# Altium schematic sheet QCopterRC_ETH_Sch.SchDoc
size A4
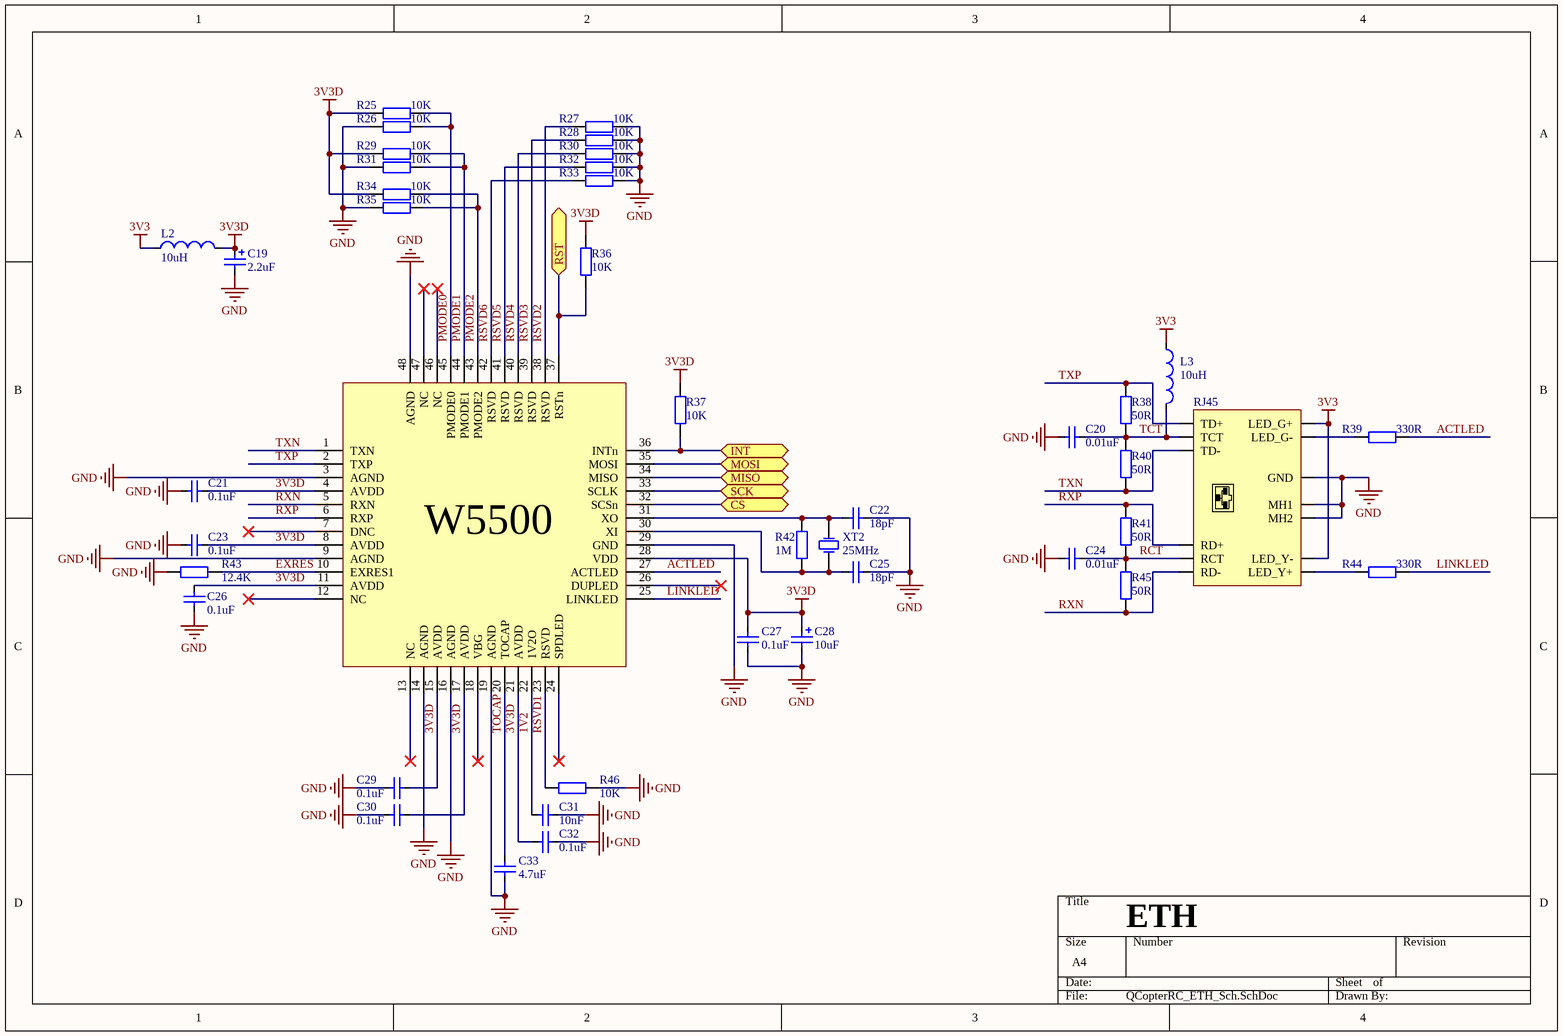
[diagram p0: QCopterRC_ETH_Sch.SchDoc]

## Parts
C19  value 2.2uF  [CAP_TAN_P0805]  (hidden comment: Cap_Tan_0805)
C20  value 0.01uF  [CAP_0603]  (hidden comment: Cap_0603)
C21  value 0.1uF  [CAP_0603]  (hidden comment: Cap_0603)
C22  value 18pF  [CAP_0603]  (hidden comment: Cap_0603)
C23  value 0.1uF  [CAP_0603]  (hidden comment: Cap_0603)
C24  value 0.01uF  [CAP_0603]  (hidden comment: Cap_0603)
C25  value 18pF  [CAP_0603]  (hidden comment: Cap_0603)
C26  value 0.1uF  [CAP_0603]  (hidden comment: Cap_0603)
C27  value 0.1uF  [CAP_0603]  (hidden comment: Cap_0603)
C28  value 10uF  [CAP_TAN_B1210]  (hidden comment: Cap_Tan_1210)
C29  value 0.1uF  [CAP_0603]  (hidden comment: Cap_0603)
C30  value 0.1uF  [CAP_0603]  (hidden comment: Cap_0603)
C31  value 10nF  [CAP_0603]  (hidden comment: Cap_0603)
C32  value 0.1uF  [CAP_0603]  (hidden comment: Cap_0603)
C33  value 4.7uF  [CAP_0603]  (hidden comment: Cap_0603)
L2  value 10uH  [IND_0603]  (hidden comment: Ind_0603)
L3  value 10uH  [IND_0603]  (hidden comment: Ind_0603)
R25  value 10K  [RES_0603]  (hidden comment: Res_0603)
R26  value 10K  [RES_0603]  (hidden comment: Res_0603)
R27  value 10K  [RES_0603]  (hidden comment: Res_0603)
R28  value 10K  [RES_0603]  (hidden comment: Res_0603)
R29  value 10K  [RES_0603]  (hidden comment: Res_0603)
R30  value 10K  [RES_0603]  (hidden comment: Res_0603)
R31  value 10K  [RES_0603]  (hidden comment: Res_0603)
R32  value 10K  [RES_0603]  (hidden comment: Res_0603)
R33  value 10K  [RES_0603]  (hidden comment: Res_0603)
R34  value 10K  [RES_0603]  (hidden comment: Res_0603)
R35  value 10K  [RES_0603]  (hidden comment: Res_0603)
R36  value 10K  [RES_0603]  (hidden comment: Res_0603)
R37  value 10K  [RES_0603]  (hidden comment: Res_0603)
R38  value 50R  [RES_0603]  (hidden comment: Res_0603)
R39  value 330R  [RES_0603]  (hidden comment: Res_0603)
R40  value 50R  [RES_0603]  (hidden comment: Res_0603)
R41  value 50R  [RES_0603]  (hidden comment: Res_0603)
R42  value 1M  [RES_0603]  (hidden comment: Res_0603)
R43  value 12.4K  [RES_0603]  (hidden comment: Res_0603)
R44  value 330R  [RES_0603]  (hidden comment: Res_0603)
R45  value 50R  [RES_0603]  (hidden comment: Res_0603)
R46  value 10K  [RES_0603]  (hidden comment: Res_0603)
RJ45  RJ45  [RJ-45_LED]  (value not drawn)
W5500  W5500  [W5500]  (value not drawn)
XT2  value 25MHz  [XTAL_5032]  (hidden comment: XTAL_5032)

## Ports
CS, INT, MISO, MOSI, RST, SCK

## Nets
3V3: L2.1 L3.1 RJ45.9(LED_G+) RJ45.11(LED_Y-)
3V3D: C19.1 C21.2 C23.2 C26.2 C27.2 C28.1 C29.1 C30.1 C32.2 L2.2 R25.2 R29.2 R34.2 R36.2 R37.2 W5500.4(AVDD) W5500.8(AVDD) W5500.11(AVDD) W5500.15(AVDD) W5500.17(AVDD) W5500.21(AVDD) W5500.28(VDD)
GND: C19.2 C20.1 C21.1 C22.1 C23.1 C24.1 C25.1 C26.1 C27.1 C28.2 C29.2 C30.2 C31.1 C32.1 C33.1 R26.2 R27.1 R28.1 R30.1 R31.2 R32.1 R33.1 R35.2 R43.2 R46.2 RJ45.8(GND) RJ45.13(MH1) RJ45.14(MH2) W5500.3(AGND) W5500.9(AGND) W5500.14(AGND) W5500.16(AGND) W5500.19(AGND) W5500.29(GND) W5500.48(AGND)
1V2: C31.2 W5500.22(1V2O)
ACTLED: R39.1 W5500.27(ACTLED)
CS: W5500.32(SCSn) ; port CS
EXRES: R43.1 W5500.10(EXRES1)
INT: R37.1 W5500.36(INTn) ; port INT
LINKLED: R44.1 W5500.25(LINKLED)
MISO: W5500.34(MISO) ; port MISO
MOSI: W5500.35(MOSI) ; port MOSI
PMODE0: R25.1 R26.1 W5500.45(PMODE0)
PMODE1: R29.1 R31.1 W5500.44(PMODE1)
PMODE2: R34.1 R35.1 W5500.43(PMODE2)
RCT: C24.2 R41.1 R45.2 RJ45.5(RCT)
RST: R36.1 W5500.37(RSTn) ; port RST
RSVD1: R46.1 W5500.23(RSVD)
RSVD2: R27.2 W5500.38(RSVD)
RSVD3: R28.2 W5500.39(RSVD)
RSVD4: R30.2 W5500.40(RSVD)
RSVD5: R32.2 W5500.41(RSVD)
RSVD6: R33.2 W5500.42(RSVD)
RXN: R45.1 RJ45.6(RD-) W5500.5(RXN)
RXP: R41.2 RJ45.3(RD+) W5500.6(RXP)
SCK: W5500.33(SCLK) ; port SCK
TCT: C20.2 L3.2 R38.1 R40.2 RJ45.4(TCT)
TOCAP: C33.2 W5500.20(TOCAP)
TXN: R40.1 RJ45.2(TD-) W5500.1(TXN)
TXP: R38.2 RJ45.1(TD+) W5500.2(TXP)
NetC22_2: C22.2 R42.2 W5500.31(XO) XT2.2(OSC2)
NetC25_2: C25.2 R42.1 W5500.30(XI) XT2.1(OSC1)
NetR39_2: R39.2 RJ45.10(LED_G-)
NetR44_2: R44.2 RJ45.12(LED_Y+)

Not connected (* = marked no-connect by the designer): W5500 7(DNC)* 12(NC)* 13(NC)* 18(VBG)* 24(SPDLED)* 26(DUPLED)* 46(NC)* 47(NC)*

## Notes on the sheet
- Labels drawn without touching a wire or pin: ETH

## Library data of the parts
C19 = Cap_Tan_0805: Capacitor
C20-C27 C29-C33 = Cap_0603: Capacitor
C28 = Cap_Tan_1210: Capacitor
L2 L3 = Ind_0603: Inductor
R25-R46 = Res_0603: Resistor
RJ45 = RJ45: ETH
W5500 = W5500: Ethernet
XT2 = XTAL_5032: Crystal Oscillator; Published: 8-Jun-2000; LatestRevisionDate: 17-Jul-2002; LatestRevisionNote: Re-released for DXP Platform.; PackageReference: R38; Publisher: Altium Limited; PackageDescription: Crystal, Thru-Hole; 2 Leads; Body 3.1 x 8.2 mm (Dia.xH)